# EAGLE design PSCON (EAGLE 5.11)
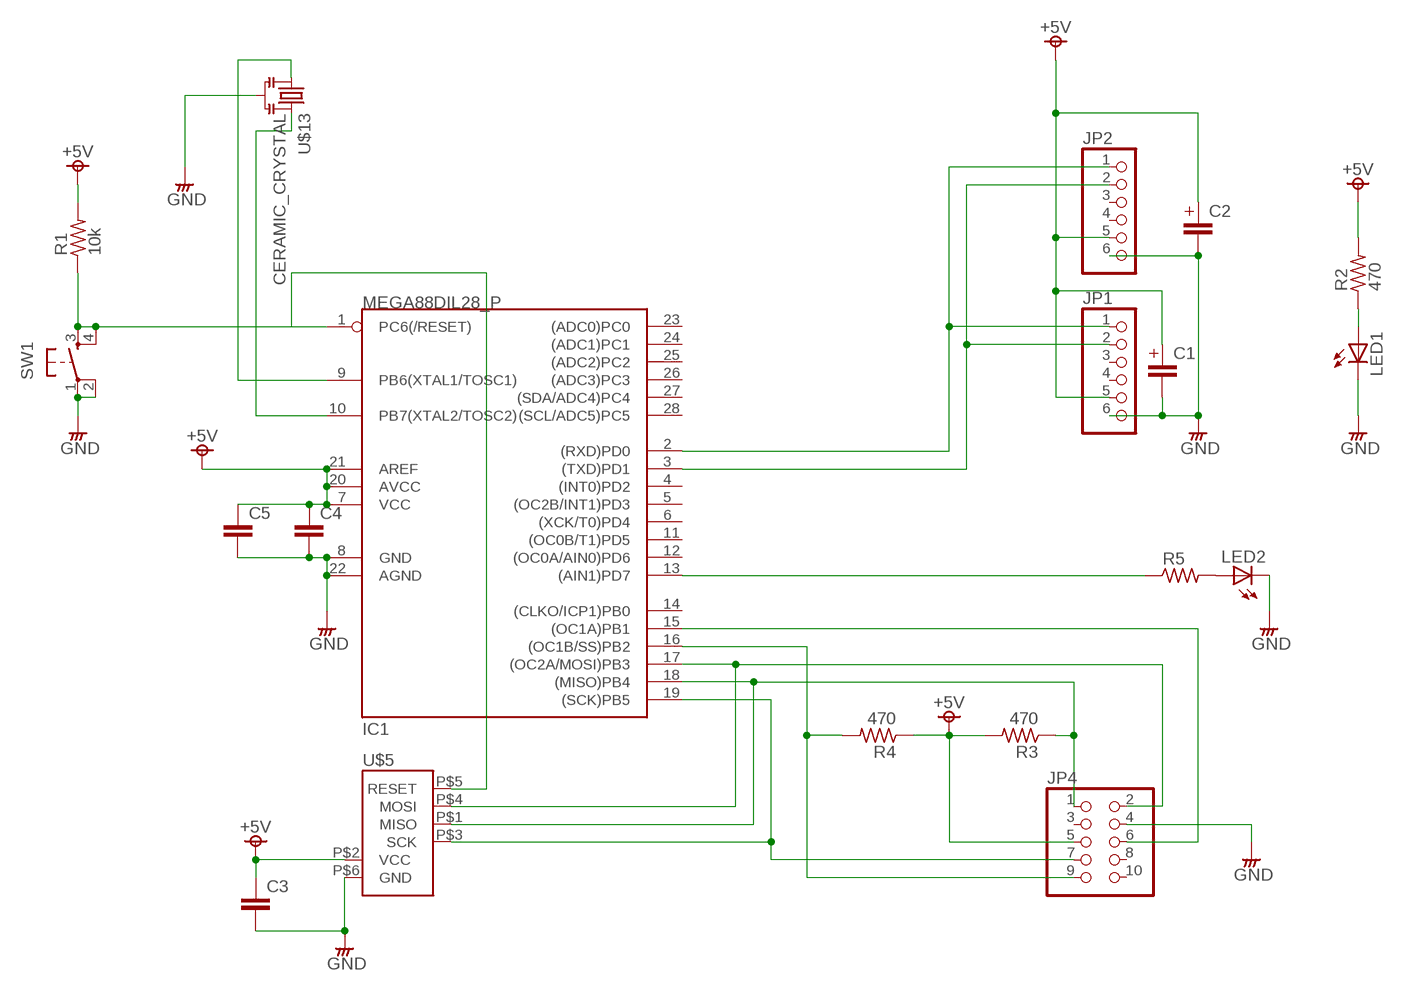
[diagram p0: schematic, sheet 1]

## Parts
C1  CAPACITORC_0.2_P  [C_0.2_P]
C2  CAPACITORC_0.2_P  [C_0.2_P]
C3  MLCCMLCC_25_P  [MLCC_25_P]
C4  MLCCMLCC_25_P  [MLCC_25_P]
C5  MLCCMLCC_25_P  [MLCC_25_P]
IC1  MEGA88DIL28_P  [DIL28_P]
JP1  PINHD-1X61*06_P  [1*06_P]
JP2  PINHD-1X61*06_P  [1*06_P]
JP4  PINHD-2X5  [2X05]
LED1  LEDLED3MM_P  [LED3MM_P]
LED2  LEDLED3MM_P  [LED3MM_P]
R1  10k  RESISTORSR_0.3_P  [R_0.3_P]
R2  470  RESISTORSR_0.3_P  [R_0.3_P]
R3  470  RESISTORSR_0.3_P  [R_0.3_P]
R4  470  RESISTORSR_0.3_P  [R_0.3_P]
R5  RESISTORSR_0.3_P  [R_0.3_P]
SW1  TACTB3F-10XX_P  [B3F-10XX_P]
U$5  ISP'''  [2X03_P]
U$13  CERAMIC_CRYSTAL  [CRYSTAL_P]

## Nets
+5V: C1.1 C2.1 C3.1 C4.1 C5.1 IC1.7(VCC) IC1.20(AVCC) IC1.21(AREF) JP1.5 JP2.5 JP4.5 R1.2 R2.2 R3.2 R4.1 U$5.P$2(VCC)
GND: C1.2 C2.2 C3.2 C4.2 C5.2 IC1.8(GND) IC1.22(AGND) JP1.6 JP2.6 JP4.4 LED1.K(C) LED2.K(C) SW1.1(P) SW1.2(P1) U$5.P$6(GND) U$13.P$2(GND)
N$1: IC1.1(PC6(/RESET)) R1.1 SW1.3(S) SW1.4(S1) U$5.P$5(RESET)
N$2: IC1.2((RXD)PD0) JP1.1 JP2.1
N$3: IC1.3((TXD)PD1) JP1.2 JP2.2
N$4: IC1.9(PB6(XTAL1/TOSC1)) U$13.P$1
N$5: LED1.A R2.1
N$6: IC1.17((OC2A/MOSI)PB3) JP4.2 U$5.P$4(MOSI)
N$7: IC1.18((MISO)PB4) JP4.1 R3.1 U$5.P$1(MISO)
N$8: IC1.19((SCK)PB5) JP4.7 U$5.P$3(SCK)
N$9: IC1.10(PB7(XTAL2/TOSC2)) U$13.P$3
N$12: IC1.15((OC1A)PB1) JP4.6
N$13: IC1.16((OC1B/SS)PB2) JP4.9 R4.2
N$14: IC1.13((AIN1)PD7) R5.1
N$15: LED2.A R5.2
Unconnected: IC1.4((INT0)PD2) IC1.5((OC2B/INT1)PD3) IC1.6((XCK/T0)PD4) IC1.11((OC0B/T1)PD5) IC1.12((OC0A/AIN0)PD6) IC1.14((CLKO/ICP1)PB0) IC1.23((ADC0)PC0) IC1.24((ADC1)PC1) IC1.25((ADC2)PC2) IC1.26((ADC3)PC3) IC1.27((SDA/ADC4)PC4) IC1.28((SCL/ADC5)PC5) JP1.3 JP1.4 JP2.3 JP2.4 JP4.3 JP4.8 JP4.10

## Library data of the parts
C1 C2 = rcl__s:CAPACITOR
C3-C5 = rcl__s:MLCC: CAPACITOR, European symbol
IC1 = avr_s:MEGA88: MICROCONTROLLER 8 Kbytes FLASH 1 kbytes SRAM 512 bytes EEPROM USART 4-channel 10 bit ADC 2-channel 8 bit ADC Source: avr.lbr
JP1 JP2 = pinhead_s:PINHD-1X6: PIN HEADER
JP4 = pinhead_s:PINHD-2X5: PIN HEADER
LED1 LED2 = LED_s:LED: LED OSRAM: - CHIPLED LG R971, LG N971, LY N971, LG Q971, LY Q971, LO R971, LY R971 LH N974, LH R974 LS Q976, LO Q976, LY Q976 LO Q996 - Hyper CHIPLED LW Q18S LB Q993, LB Q99A, LB R99A - SideLED LS A670, LO A670, LY A670, LG A670, LP A670 LB A673, LV A673, LT A673, LW A673 LH A674 LY A675 LS A676, LA A676, LO A676, LY A676, LW A676 LS A679, LY A679, LG A679 - Hyper Micro SIDELED® LS Y876, LA Y876, LO Y876, LY Y876 LT Y87S - SmartLED LW L88C, LW L88S LB L89C, LB L89S, LG L890 LS L89K, LO L89K, LY L89K LS L896, LA L896, LO L896, LY L896 - TOPLED LS T670, LO T670, LY T670, LG T670, LP T670 LSG T670, LSP T670, LSY T670, LOP T670, LYG T670 LG T671, LOG T671, LSG T671 LB T673, LV T673, LT T673, LW T673 LH T674 LS T676, LA T676, LO T676, LY T676, LB T676, LH T676, LSB T676, LW T676 LB T67C, LV T67C, LT T67C, LS T67K, LO T67K, LY T67K, LW E67C LS E67B, LA E67B, LO E67B, LY E67B, LB E67C, LV E67C, LT E67C LW T67C LS T679, LY T679, LG T679 LS T770, LO T770, LY T770, LG T770, LP T770 LB T773, LV T773, LT T773, LW T773 LH T774 LS E675, LA E675, LY E675, LS T675 LS T776, LA T776, LO T776, LY T776, LB T776 LHGB T686 LT T68C, LB T68C - Hyper Mini TOPLED® LB M676 - Mini TOPLED Santana® LG M470 LS M47K, LO M47K, LY M47K Source: http://www.osram.convergy.de - LUMILED® LXK2-PW12-R00, LXK2-PW12-S00, LXK2-PW14-U00, LXK2-PW14-V00 LXK2-PM12-R00, LXK2-PM12-S00, LXK2-PM14-U00 LXK2-PE12-Q00, LXK2-PE12-R00, LXK2-PE12-S00, LXK2-PE14-T00, LXK2-PE14-U00 LXK2-PB12-K00, LXK2-PB12-L00, LXK2-PB12-M00, LXK2-PB14-N00, LXK2-PB14-P00, LXK2-PB14-Q00 LXK2-PR12-L00, LXK2-PR12-M00, LXK2-PR14-Q00, LXK2-PR14-R00 LXK2-PD12-Q00, LXK2-PD12-R00, LXK2-PD12-S00 LXK2-PH12-R00, LXK2-PH12-S00 LXK2-PL12-P00, LXK2-PL12-Q00, LXK2-PL12-R00 Source: www.luxeon.com
R1-R5 = rcl__s:RESISTORS
SW1 = switch_s:TACT: OMRON SWITCH
U$5 = pinhead_s:ISP
U$13 = crystal_s:CERAMIC_CRYSTAL

## Board
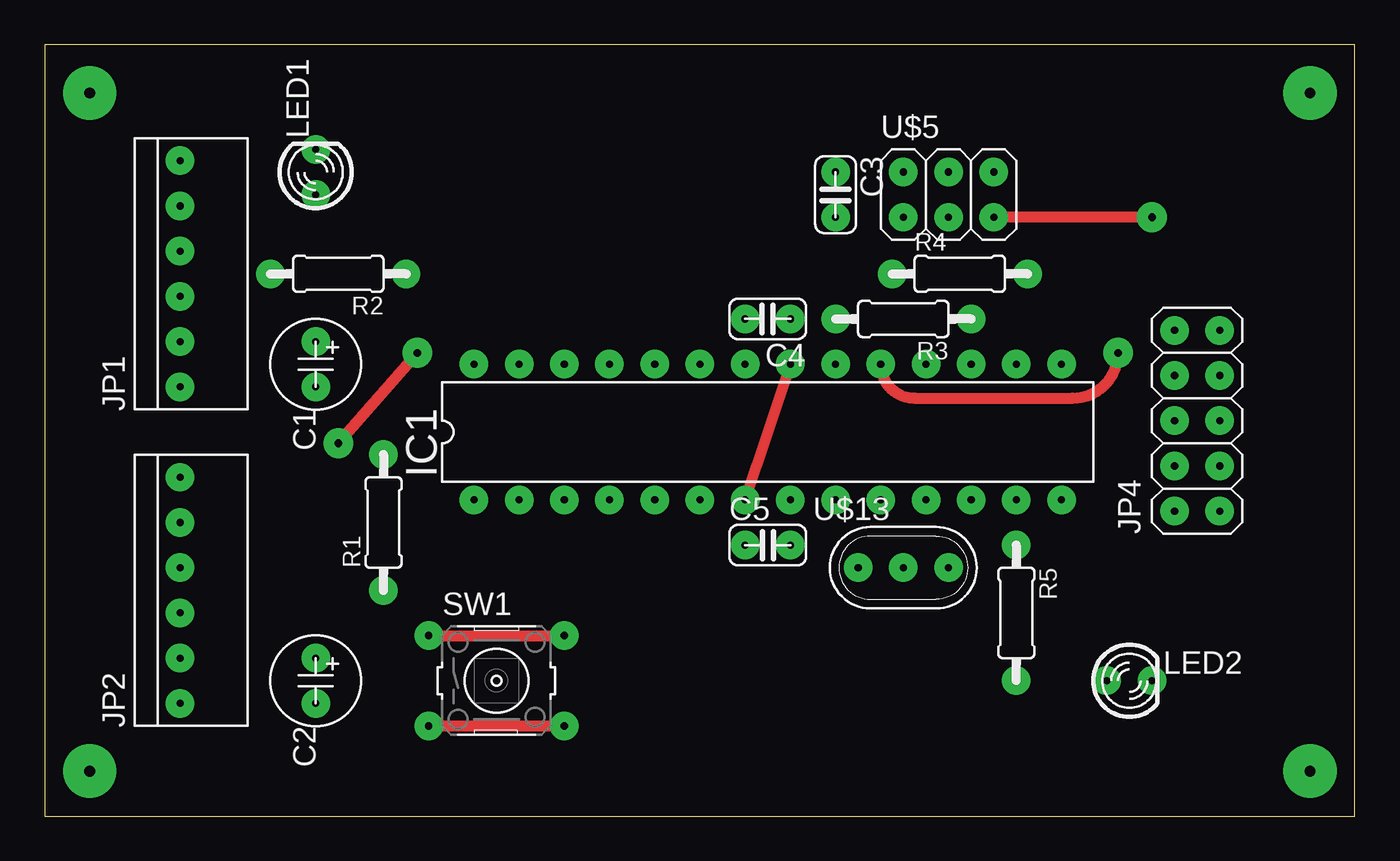
[diagram p1: board, top side]
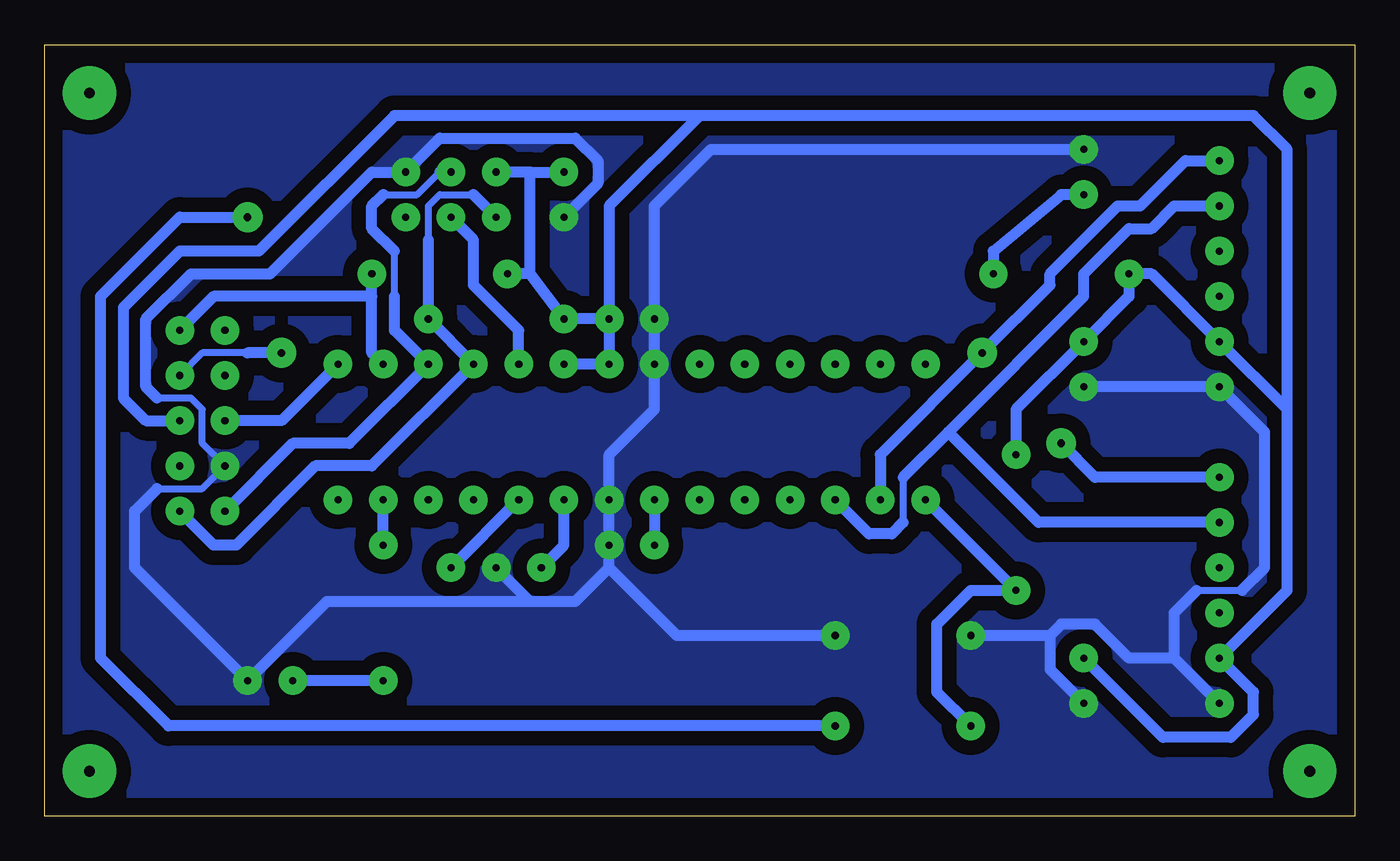
[diagram p2: board, bottom side, seen from below]

Size 73.64 x 43.36 mm. Coordinates in mm from the lower left corner, seen from the top.
Outline: 0,0 73.64,0 73.64,43.36 0,43.36 0,0
Copper layers (1*16): Top 0.035mm / dielectric 1.5mm / Bottom 0.035mm
Design rules "default": minimum track width 10mil, minimum drill 24mil, track to track 8mil, track to pad 8mil, pad to pad 8mil, via to via 8mil, smd to smd 8mil, copper to edge 40mil, drill to drill 8mil, minimum pad ring 10mil, minimum via ring 8mil, stop-mask expansion 4mil, vias tented up to drill 0mil, thermal gap 10mil

### Footprints (pad centres in the part's own frame; a part is rotated, then mirrored left to right if it is on the bottom)
C_0.2_P = drill 0.4 pad 1.6 round: 1 -1.27,0; 2 1.27,0
MLCC_25_P = drill 0.4 pad 1.6 round: 1 -1.27,0; 2 1.27,0
DIL28_P = drill 0.4 pad 1.6 round: 1 -3.81,11.43; 2 -3.81,8.89; 3 -3.81,6.35; 4 -3.81,3.81; 5 -3.81,1.27; 6 -3.81,-1.27; 7 -3.81,-3.81; 8 -3.81,-6.35; 9 -3.81,-8.89; 10 -3.81,-11.43; 11 -3.81,-13.97; 12 -3.81,-16.51; 13 -3.81,-19.05; 14 -3.81,-21.59; 15 3.81,-21.59; 16 3.81,-19.05; 17 3.81,-16.51; 18 3.81,-13.97; 19 3.81,-11.43; 20 3.81,-8.89; 21 3.81,-6.35; 22 3.81,-3.81; 23 3.81,-1.27; 24 3.81,1.27; 25 3.81,3.81; 26 3.81,6.35; 27 3.81,8.89; 28 3.81,11.43
1*06_P = drill 0.4 pad 1.6 round: 1 6.35,0; 2 3.81,0; 3 1.27,0; 4 -1.27,0; 5 -3.81,0; 6 -6.35,0
2X05 = drill 0.4 pad 1.6 round: 1 -5.08,-1.27; 2 -5.08,1.27; 3 -2.54,-1.27; 4 -2.54,1.27; 5 0,-1.27; 6 0,1.27; 7 2.54,-1.27; 8 2.54,1.27; 9 5.08,-1.27; 10 5.08,1.27
LED3MM_P = drill 0.4 pad 1.6 round: A -1.27,0; K 1.27,0
R_0.3_P = drill 0.4 pad 1.6 round: 1 -3.81,0; 2 3.81,0
B3F-10XX_P = drill 0.4 pad 1.6 round: 1 -3.81,2.54; 2 3.81,2.54; 3 -3.81,-2.54; 4 3.81,-2.54
2X03_P = drill 0.4 pad 1.6 round: P$1 -2.54,-1.27; P$2 -2.54,1.27; P$3 0,-1.27; P$4 0,1.27; P$5 2.54,-1.27; P$6 2.54,1.27
CRYSTAL_P = drill 0.4 pad 1.6 round: P$1 -2.54,0; P$2 0,0; P$3 2.54,0

### Placement (x,y rotation side)
C1  15.24,25.4 270 top
C2  15.24,7.62 270 top
C3  44.45,34.92 270 top
C4  40.64,27.94 180 top
C5  40.64,15.24 0 top
IC1  35.56,21.59 90 top
JP1  7.62,30.48 90 top
JP2  7.62,12.7 90 top
JP4  64.77,22.23 90 top
LED1  15.24,36.2 90 top
LED2  60.96,7.62 0 top
R1  19.05,16.51 90 top
R2  16.51,30.48 180 top
R3  48.26,27.94 180 top
R4  51.44,30.48 0 top
R5  54.61,11.43 270 top
SW1  25.4,7.62 0 top
U$5  50.8,34.92 0 top
U$13  48.26,13.97 0 top

### Tracks (layer width: path | path; a pad name or v marks a point on that pad's centre or on a via)
+5V
  Top 0.61: IC1.21 IC1.7
  Bottom 0.61: 3.81,22.86 3.81,12.7 JP2.5 5.71,6.99 5.71,5.71 6.99,4.45 10.79,4.45 C2.1 | 3.81,22.86 JP1.5 11.43,30.48 R2.2 12.7,29.21 C1.1 19.05,22.86 R1.2 | C4.1 IC1.21 IC1.20 | 36.83,39.37 5.71,39.37 3.81,37.47 3.81,22.86 | IC1.7 C5.1 | 36.83,39.37 41.91,34.29 C4.1 | C4.1 R3.2 46.35,30.48 | 46.35,30.48 46.35,36.2 | 46.35,36.2 U$5.P$2 | 46.35,30.48 R4.1 | 46.35,36.2 C3.1 | JP4.5 67.94,22.23 69.22,23.5 69.22,28.57 66.04,31.75 61.59,31.75 53.98,39.37 36.83,39.37
GND
  Top 0.61: SW1.1 SW1.2
  Bottom 0.406: 8.89,12.7 6.35,12.7 | 67.31,18.41 64.77,18.41 JP4.4 64.77,20.95 64.77,22.86 65.41,23.5 67.31,23.5
  Bottom 0.61: JP2.6 10.16,8.89 | 10.16,8.89 10.16,11.43 8.89,12.7 | 6.35,12.7 5.08,13.97 5.08,21.59 JP1.6 C1.2 | 10.16,8.89 12.7,8.89 14.61,10.79 16.51,10.79 17.14,10.16 | 17.14,10.16 17.14,8.26 C2.2 | 17.14,10.16 SW1.1 | LED1.K 36.2,37.47 39.37,34.29 C4.2 IC1.22 39.37,22.86 41.91,20.32 IC1.8 C5.2 41.91,13.97 | 41.91,13.97 38.1,10.16 SW1.2 | 46.35,12.06 U$13.P$2 | 46.35,12.06 43.81,12.06 41.91,13.97 | 46.35,12.06 57.78,12.06 LED2.K 68.58,13.97 68.58,17.14 67.31,18.41 | C3.2 42.55,35.56 42.55,36.83 43.81,38.1 51.44,38.1 U$5.P$6 55.24,36.2 60.96,30.48 65.41,30.48 67.94,27.94 67.94,24.13 67.31,23.5
  pour Bottom (isolate 0.813, no thermals): -0.64,44.45 -0.64,-0.64 74.3,-0.64 74.3,44.45
N$1  (via drill 0.43 pad 1.68)
  Top 0.61: SW1.3 SW1.4 | v62.23,33.66 U$5.P$5
  Bottom 0.61: SW1.3 23.5,6.99 23.5,10.79 21.59,12.7 R1.1 IC1.1 | SW1.4 66.67,5.08 70.48,8.89 70.48,29.21 66.04,33.66 v62.23,33.66
N$2  (via drill 0.43 pad 1.68)
  Top 0.61: v16.51,20.95 v20.95,26.04
  Bottom 0.61: JP1.1 9.53,36.83 12.06,34.29 13.34,34.29 17.14,30.48 17.14,29.84 v20.95,26.04 26.67,20.32 IC1.2 | JP2.1 14.61,19.05 v16.51,20.95
N$3
  Bottom 0.406: 25.4,19.05 25.4,16.51
  Bottom 0.61: JP1.2 10.16,34.29 11.43,33.02 12.7,33.02 15.24,30.48 15.24,29.21 22.86,21.59 | 22.86,21.59 25.4,19.05 | 25.4,16.51 26.04,15.88 27.3,15.88 IC1.3 | JP2.2 17.78,16.51 22.86,21.59
N$4
  Bottom 0.61: U$13.P$1 44.45,15.24 IC1.9
N$5
  Bottom 0.61: R2.1 20.32,31.75 16.51,34.92 LED1.A
N$6
  Bottom 0.406: 53.98,29.21 53.98,31.75 | 51.44,36.2 52.7,34.92 54.61,34.92
  Bottom 0.61: 53.98,29.21 53.98,27.3 IC1.17 56.52,20.95 59.69,20.95 JP4.2 | 51.44,36.2 U$5.P$4 | 54.61,34.92 55.24,34.29 55.24,33.02 53.98,31.75
N$7
  Bottom 0.406: 49.53,34.92 51.44,34.92 52.07,34.29 52.07,32.38
  Bottom 0.61: 49.53,34.92 U$5.P$1 | JP4.1 64.14,15.24 62.87,15.24 58.42,19.68 55.24,19.68 IC1.18 R3.1 52.07,32.38
N$8  (via drill 0.43 pad 1.68)
  Top 0.61: v60.33,26.04 arc-90 57.78,23.5 48.9,23.5 arc-90 IC1.19
  Bottom 0.406: JP4.7 64.77,26.04 62.23,26.04
  Bottom 0.61: IC1.19 46.99,27.3 49.53,29.84 49.53,32.38 U$5.P$3 | v60.33,26.04 62.23,26.04
N$9
  Bottom 0.61: U$13.P$3 IC1.10
N$10  (via drill 0.6 pad 3)
  other vias: 2.54,40.64
N$11  (via drill 0.6 pad 3)
  other vias: 2.54,2.54
N$12
  Bottom 0.61: JP4.6 60.33,22.23 IC1.15
N$13
  Bottom 0.61: 55.24,29.21 55.24,26.04 IC1.16 | 55.24,29.21 R4.2 | JP4.9 64.14,29.21 55.24,29.21
N$14
  Bottom 0.61: R5.1 IC1.13
N$15
  Bottom 0.61: R5.2 LED2.A
N$16  (via drill 0.6 pad 3)
  other vias: 71.12,2.54
N$17  (via drill 0.6 pad 3)
  other vias: 71.12,40.64